# EAGLE design Uplink_controller (EAGLE 5.06)
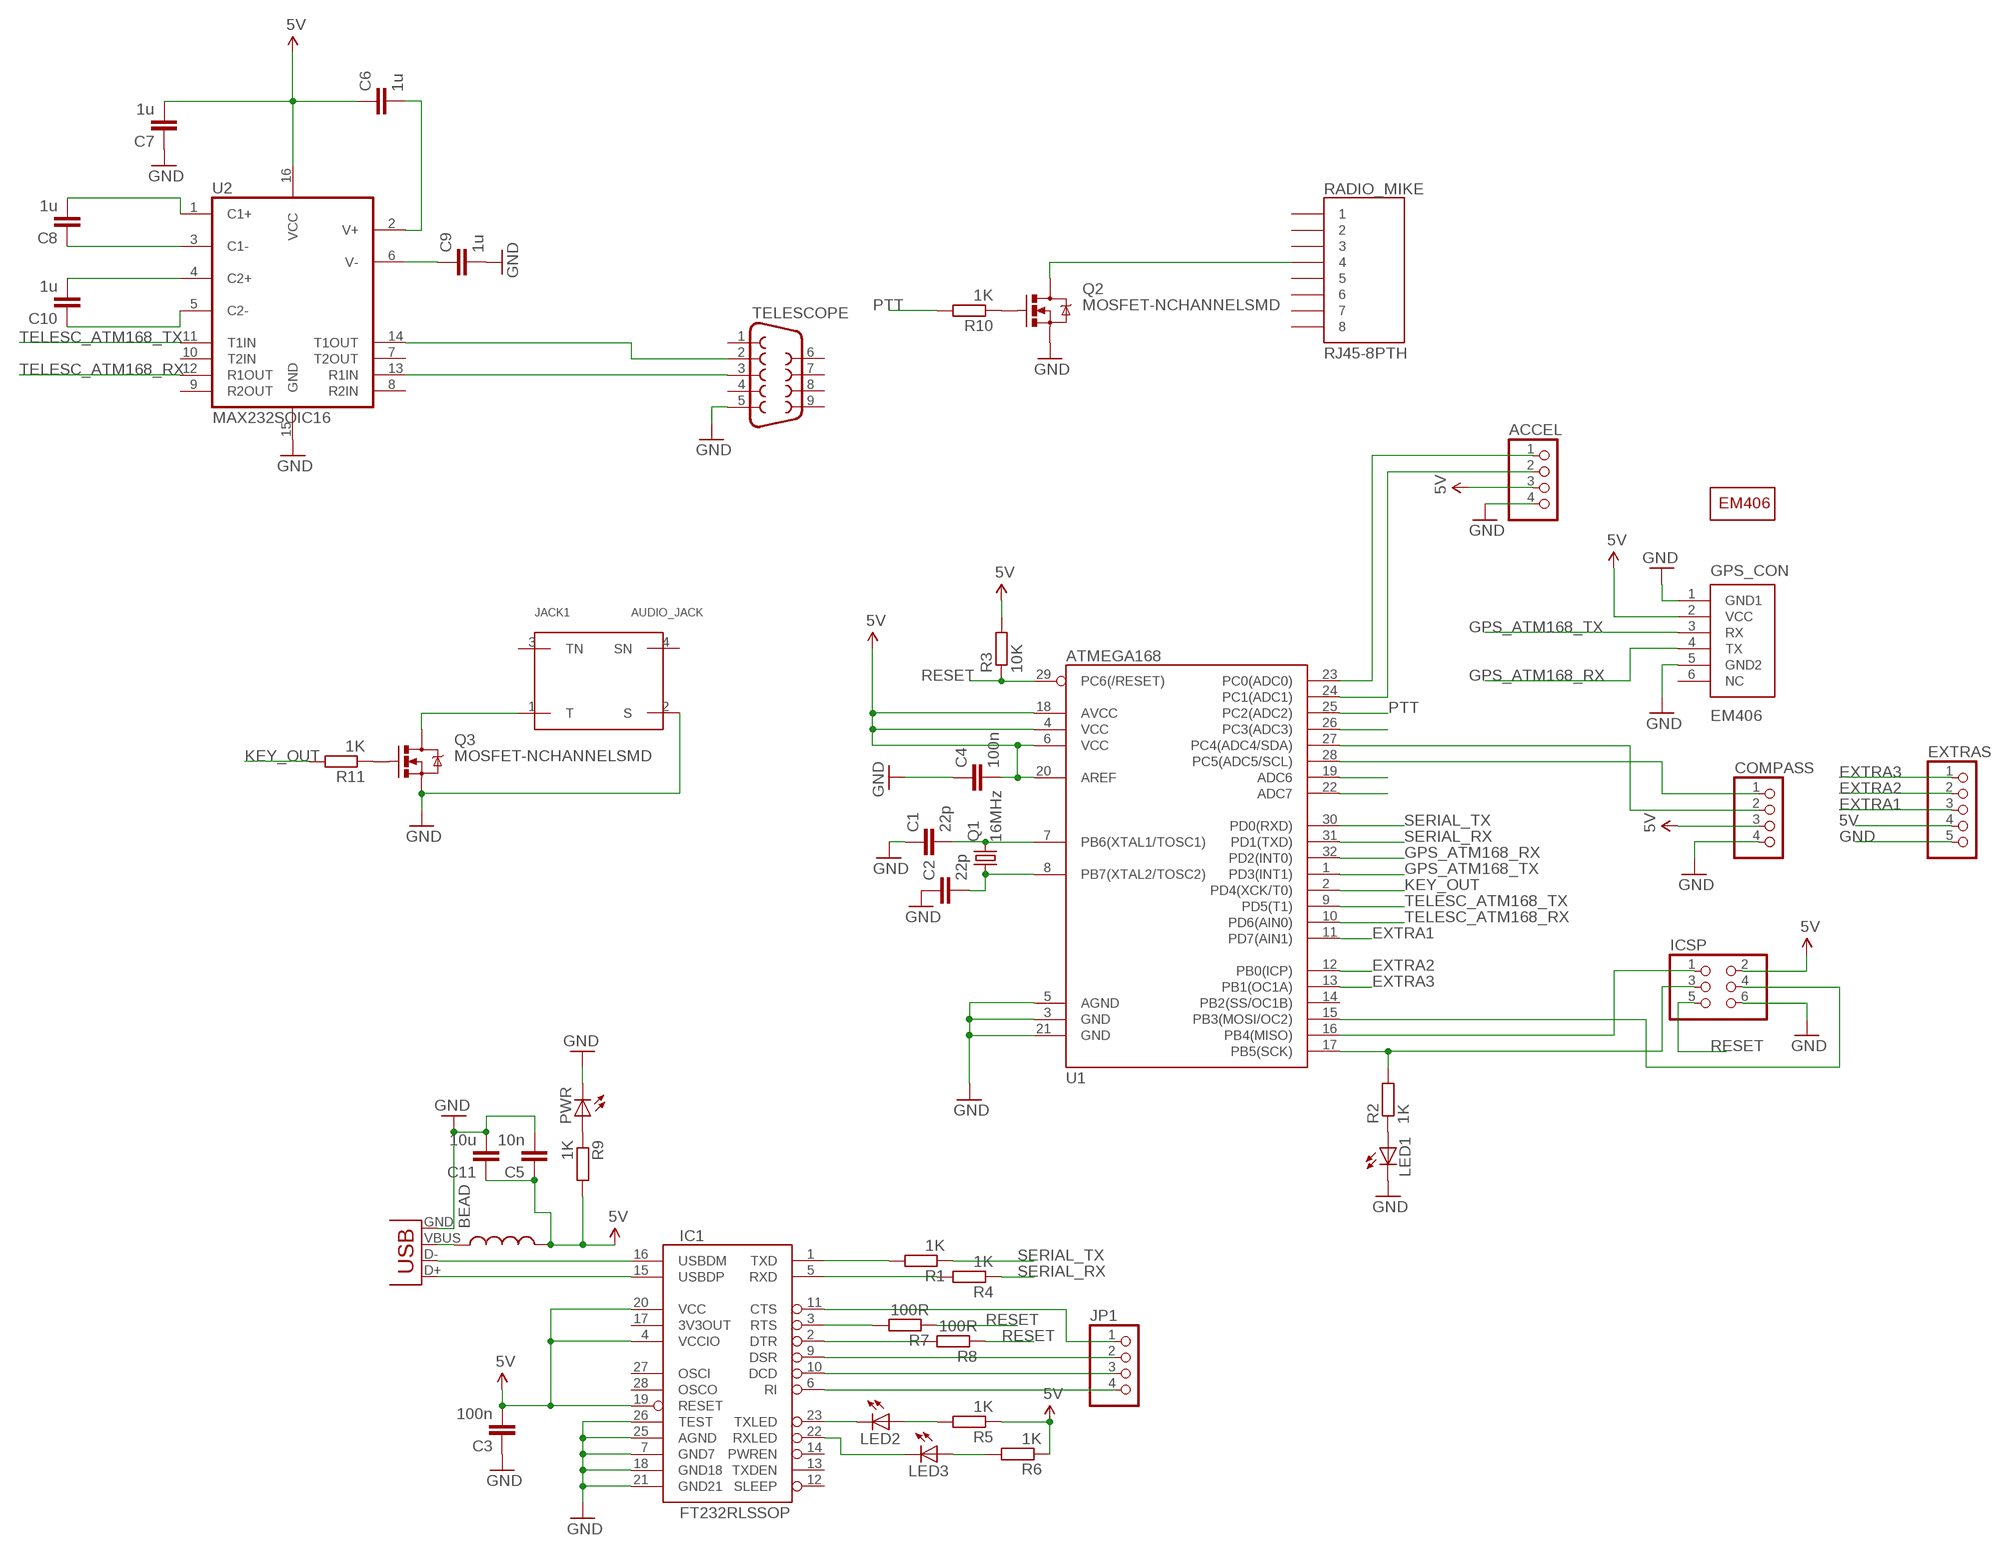
[diagram p0: schematic, sheet 1]

## Parts
ACCEL  PINHD-1X4  [1X04]
BEAD  INDUCTOR0603  [0603]
C1  22p  CAP0603-CAP  [0603-CAP]
C2  22p  CAP0603-CAP  [0603-CAP]
C3  100n  CAP0603-CAP  [0603-CAP]
C4  100n  CAP0603-CAP  [0603-CAP]
C5  10n  CAP0603-CAP  [0603-CAP]
C6  1u  CAP0603-CAP  [0603-CAP]
C7  1u  CAP0603-CAP  [0603-CAP]
C8  1u  CAP0603-CAP  [0603-CAP]
C9  1u  CAP0603-CAP  [0603-CAP]
C10  1u  CAP0603-CAP  [0603-CAP]
C11  10u  CAP0603-CAP  [0603-CAP]
COMPASS  PINHD-1X4  [1X04]
EXTRAS  PINHD-1X5  [1X05]
GPS_CON  EM406  [EM406]
IC1  FT232RLSSOP  [SSOP28DB]
ICSP  PINHD-2X3  [2X03]
JACK1  AUDIO_JACK  [AUDIO_JACK_NMJ4HFD2]
JP1  PINHD-1X4  [1X04]
LED1  LEDCHIPLED_0603  [CHIPLED_0603]
LED2  LEDCHIPLED_0603  [CHIPLED_0603]
LED3  LEDCHIPLED_0603  [CHIPLED_0603]
PWR  LEDCHIPLED_0603  [CHIPLED_0603]
Q1  16MHz  CRYSTAL5X3  [CRYSTAL-SMD-5X3]
Q2  MOSFET-NCHANNELSMD  [SOT23-3]
Q3  MOSFET-NCHANNELSMD  [SOT23-3]
R1  1K  R-EU_R0603  [R0603]
R2  1K  R-EU_R0603  [R0603]
R3  10K  R-EU_R0603  [R0603]
R4  1K  R-EU_R0603  [R0603]
R5  1K  R-EU_R0603  [R0603]
R6  1K  R-EU_R0603  [R0603]
R7  100R  R-EU_R0603  [R0603]
R8  100R  R-EU_R0603  [R0603]
R9  1K  R-EU_R0603  [R0603]
R10  1K  R-EU_R0603  [R0603]
R11  1K  R-EU_R0603  [R0603]
RADIO_MIKE  RJ45-8PTH  [RJ45-8]
TELESCOPE  DB9  [DB9]
U1  ATMEGA168  [TQFP32-08]
U2  MAX232SOIC16  [SO016]
U$7  EM406_OUTLINE  [EM406_OUTLINE]
X1  USBSMD  [USB-MINIB]

## Nets
5V: ACCEL.3 BEAD.2 C3.2 C4.2 C5.1 C6.1 C7.2 C11.1 COMPASS.3 EXTRAS.4 GPS_CON.2(VCC) IC1.4(VCCIO) IC1.19(RESET) IC1.20(VCC) ICSP.2 R3.2 R5.1 R6.1 R9.2 U1.4(VCC) U1.6(VCC) U1.18(AVCC) U1.20(AREF) U2.16(VCC)
EXTRA1: EXTRAS.3 U1.11(PD7(AIN1))
EXTRA2: EXTRAS.2 U1.12(PB0(ICP))
EXTRA3: EXTRAS.1 U1.13(PB1(OC1A))
GND: ACCEL.4 C1.1 C2.1 C3.1 C4.1 C5.2 C7.1 C9.2 C11.2 COMPASS.4 EXTRAS.5 GPS_CON.1(GND1) GPS_CON.5(GND2) IC1.7(GND7) IC1.18(GND18) IC1.21(GND21) IC1.25(AGND) IC1.26(TEST) ICSP.6 JACK1.2(S) LED1.C PWR.C Q2.2(S) Q3.2(S) TELESCOPE.5 U1.3(GND) U1.5(AGND) U1.21(GND) U2.15(GND) X1.GND
GPS_ATM168_RX: GPS_CON.4(TX) U1.32(PD2(INT0))
GPS_ATM168_TX: GPS_CON.3(RX) U1.1(PD3(INT1))
KEY_OUT: R11.2 U1.2(PD4(XCK/T0))
MISO: ICSP.1 U1.16(PB4(MISO))
MOSI: ICSP.4 U1.15(PB3(MOSI/OC2))
N$1: C1.2 Q1.3 U1.7(PB6(XTAL1/TOSC1))
N$2: C2.2 Q1.1 U1.8(PB7(XTAL2/TOSC2))
N$4: LED1.A R2.1
N$6: IC1.1(TXD) R1.2
N$7: IC1.5(RXD) R4.2
N$8: LED2.A R5.2
N$9: IC1.23(TXLED) LED2.C
N$10: IC1.22(RXLED) LED3.C
N$11: LED3.A R6.2
N$12: IC1.16(USBDM) X1.D-
N$13: IC1.15(USBDP) X1.D+
N$14: TELESCOPE.3 U2.13(R1IN)
N$15: IC1.6(RI) JP1.4
N$16: IC1.10(DCD) JP1.3
N$17: IC1.9(DSR) JP1.2
N$18: IC1.11(CTS) JP1.1
N$19: IC1.3(RTS) R7.2
N$20: IC1.2(DTR) R8.2
N$21: Q2.3(D) RADIO_MIKE.4
N$22: JACK1.1(T) Q3.3(D)
N$24: PWR.A R9.1
N$25: Q2.1(G) R10.1
N$26: C8.2 U2.1(C1+)
N$27: COMPASS.1 U1.28(PC5(ADC5/SCL))
N$28: COMPASS.2 U1.27(PC4(ADC4/SDA))
N$29: C8.1 U2.3(C1-)
N$30: ACCEL.1 U1.23(PC0(ADC0))
N$31: C10.2 U2.4(C2+)
N$32: C10.1 U2.5(C2-)
N$33: C9.1 U2.6(V-)
N$34: C6.2 U2.2(V+)
N$35: Q3.1(G) R11.1
N$36: BEAD.1 X1.VBUS
N$39: U1.26(PC3(ADC3))
N$40: U1.19(ADC6)
N$41: U1.22(ADC7)
N$42: ACCEL.2 U1.24(PC1(ADC1))
PTT: R10.2 U1.25(PC2(ADC2))
RAND: TELESCOPE.2 U2.14(T1OUT)
RESET: ICSP.5 R3.1 R7.1 R8.1 U1.29(PC6(/RESET))
SCK: ICSP.3 R2.2 U1.17(PB5(SCK))
SERIAL_RX: R4.1 U1.31(PD1(TXD))
SERIAL_TX: R1.1 U1.30(PD0(RXD))
TELESC_ATM168_RX: U1.10(PD6(AIN0)) U2.12(R1OUT)
TELESC_ATM168_TX: U1.9(PD5(T1)) U2.11(T1IN)
Unconnected: GPS_CON.6(NC) IC1.12(SLEEP) IC1.13(TXDEN) IC1.14(PWREN) IC1.17(3V3OUT) IC1.27(OSCI) IC1.28(OSCO) JACK1.3(TN) JACK1.4(SN) RADIO_MIKE.1 RADIO_MIKE.2 RADIO_MIKE.3 RADIO_MIKE.5 RADIO_MIKE.6 RADIO_MIKE.7 RADIO_MIKE.8 TELESCOPE.1 TELESCOPE.4 TELESCOPE.6 TELESCOPE.7 TELESCOPE.8 TELESCOPE.9 U1.14(PB2(SS/OC1B)) U2.7(T2OUT) U2.8(R2IN) U2.9(R2OUT) U2.10(T2IN)

## Library data of the parts
ACCEL COMPASS JP1 = pinhead:PINHD-1X4: PIN HEADER
BEAD = SparkFun:INDUCTOR: Inductors Basic Inductor/Choke - 0603 and 1206. Footprints are not proven and vary greatly between part numbers.
C1-C11 = SparkFun:CAP: Capacitor Standard 0603 ceramic capacitor, and 0.1" leaded capacitor.
EXTRAS = pinhead:PINHD-1X5: PIN HEADER
GPS_CON = SparkFun:EM406: EM406 Connector Proven layout and schematic for EM406 connector. Spark Fun Electronics SKU : GPS-00579
IC1 = SparkFun:FT232RL: USB UART FT232RL 4th Generation USB UART (USB <-> Serial) Controller. Spark Fun Electronics SKU : COM-00650
ICSP = pinhead:PINHD-2X3: PIN HEADER
JACK1 = uplink_controller:AUDIO_JACK
LED1-LED3 PWR = led:LED: LED OSRAM: - CHIPLED LG R971, LG N971, LY N971, LG Q971, LY Q971, LO R971, LY R971 LH N974, LH R974 LS Q976, LO Q976, LY Q976 LO Q996 - Hyper CHIPLED LW Q18S LB Q993, LB Q99A, LB R99A - SideLED LS A670, LO A670, LY A670, LG A670, LP A670 LB A673, LV A673, LT A673, LW A673 LH A674 LY A675 LS A676, LA A676, LO A676, LY A676, LW A676 LS A679, LY A679, LG A679 - Hyper Micro SIDELED® LS Y876, LA Y876, LO Y876, LY Y876 LT Y87S - SmartLED LW L88C, LW L88S LB L89C, LB L89S, LG L890 LS L89K, LO L89K, LY L89K LS L896, LA L896, LO L896, LY L896 - TOPLED LS T670, LO T670, LY T670, LG T670, LP T670 LSG T670, LSP T670, LSY T670, LOP T670, LYG T670 LG T671, LOG T671, LSG T671 LB T673, LV T673, LT T673, LW T673 LH T674 LS T676, LA T676, LO T676, LY T676, LB T676, LH T676, LSB T676, LW T676 LB T67C, LV T67C, LT T67C, LS T67K, LO T67K, LY T67K, LW E67C LS E67B, LA E67B, LO E67B, LY E67B, LB E67C, LV E67C, LT E67C LW T67C LS T679, LY T679, LG T679 LS T770, LO T770, LY T770, LG T770, LP T770 LB T773, LV T773, LT T773, LW T773 LH T774 LS E675, LA E675, LY E675, LS T675 LS T776, LA T776, LO T776, LY T776, LB T776 LHGB T686 LT T68C, LB T68C - Hyper Mini TOPLED® LB M676 - Mini TOPLED Santana® LG M470 LS M47K, LO M47K, LY M47K Source: http://www.osram.convergy.de LUXEON: - LUMILED® LXK2-PW12-R00, LXK2-PW12-S00, LXK2-PW14-U00, LXK2-PW14-V00 LXK2-PM12-R00, LXK2-PM12-S00, LXK2-PM14-U00 LXK2-PE12-Q00, LXK2-PE12-R00, LXK2-PE12-S00, LXK2-PE14-T00, LXK2-PE14-U00 LXK2-PB12-K00, LXK2-PB12-L00, LXK2-PB12-M00, LXK2-PB14-N00, LXK2-PB14-P00, LXK2-PB14-Q00 LXK2-PR12-L00, LXK2-PR12-M00, LXK2-PR14-Q00, LXK2-PR14-R00 LXK2-PD12-Q00, LXK2-PD12-R00, LXK2-PD12-S00 LXK2-PH12-R00, LXK2-PH12-S00 LXK2-PL12-P00, LXK2-PL12-Q00, LXK2-PL12-R00 Source: www.luxeon.com KINGBRIGHT: KA-3528ASYC Source: www.kingbright.com
Q1 = SparkFun:CRYSTAL: Crystals Various standard crystals. Proven footprints. Spark Fun Electronics SKU : COM-00534
Q2 Q3 = SparkFun:MOSFET-NCHANNEL
R1-R11 = rcl:R-EU_: RESISTOR, European symbol
RADIO_MIKE = SparkFun:RJ45-8: RJ45 Jack Simple RJ45, 8-pin connection - connector for common Cat5, Cat5e, and Cat6 Ethernet cables. Footprint not yet proven in production. Connector sku is PRT-00643; Breakout PCB sku is BOB-00716.
TELESCOPE = SparkFun:DB9: DB9 Connector Standard DB9 (D-Sub 9) serial connector. Can be used for CAN bus as well as RS485 and RS232. Footprint production proven. Spark Fun Electronics SKU : PRT-00429
U1 = SparkFun:ATMEGA168
U2 = SparkFun:MAX232: RS232 Transceiver Very common IC. This is generically called 'MAX232', but works with the 3V equivalent MAX3232 generic ICs. Field tested and mother approved. Spark Fun Electronics SKU : COM-00316 (DIP) and COM-00589 (SMD)
U$7 = SparkFun:EM406_OUTLINE
X1 = SparkFun:USB: USB Connectors USB-B-PTH is fully proven SKU : PRT-00139 USB-miniB is fully proven SKU : PRT-00587 USB-A-PCB is untested. USB-A-H is throughly reviewed, but untested. Spark Fun Electronics SKU : PRT-00437 USB-B-SMT is throughly reviewed, but untested. Needs silkscreen touching up. USB-A-S has not been used/tested USB-MB-H has not been used/tested

## Board
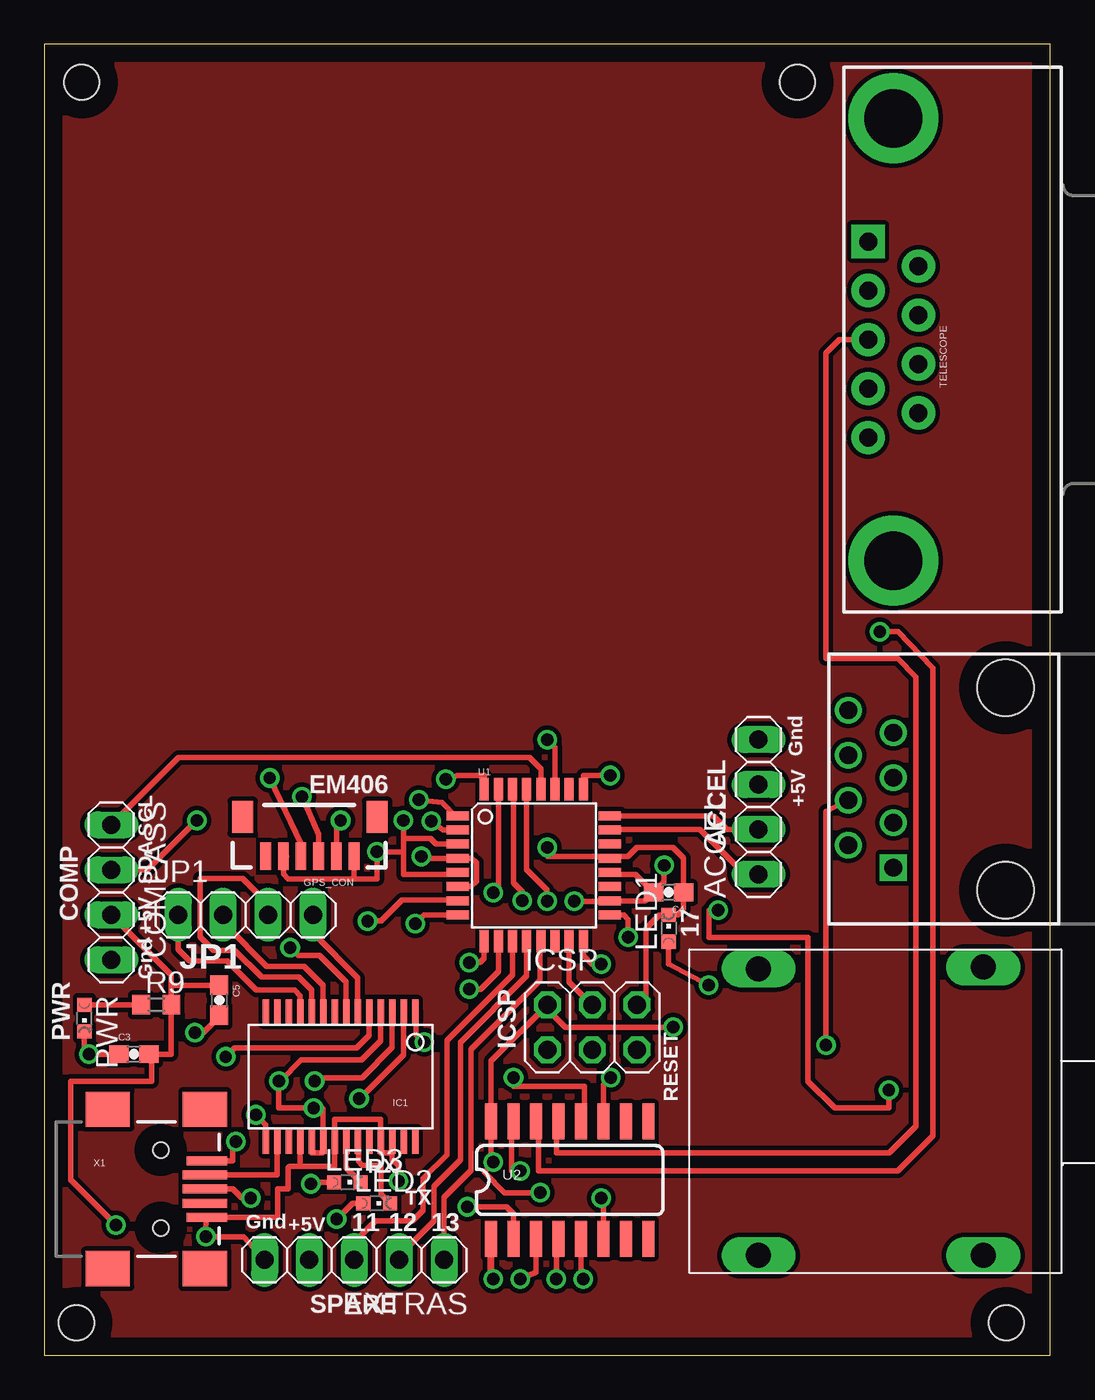
[diagram p1: board, top side]
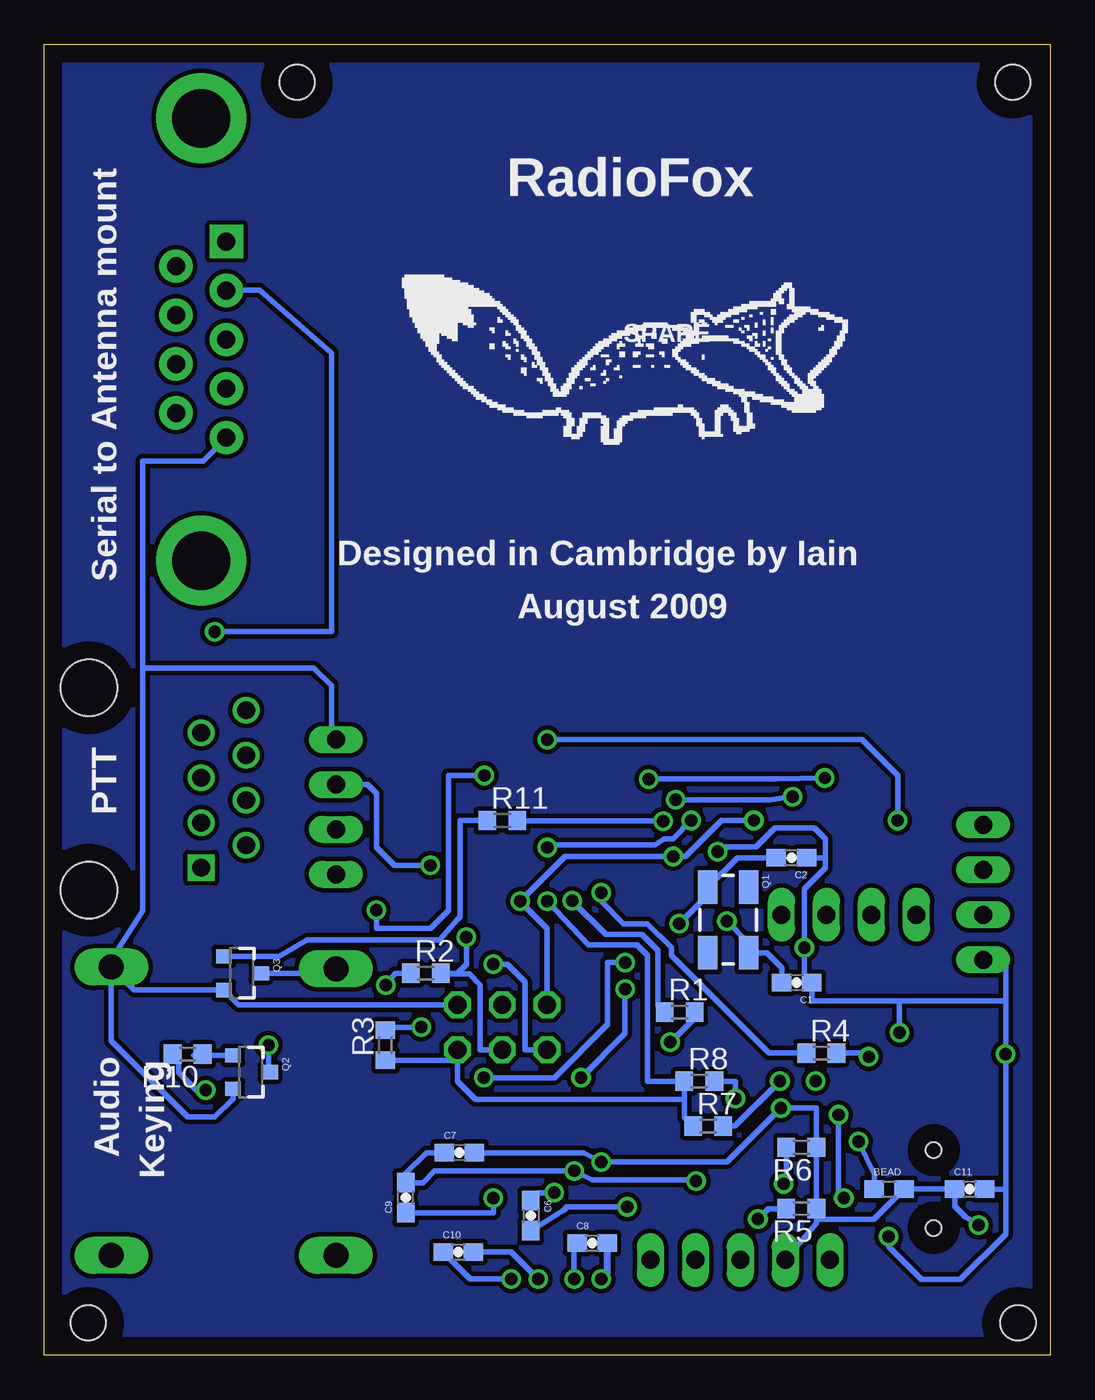
[diagram p2: board, bottom side, seen from below]

Size 56.86 x 74.09 mm. Coordinates in mm from the lower left corner, seen from the top.
Outline: 0,0 56.86,0 56.86,74.09 0,74.09 0,0
Copper layers (1*16): Top 0.035mm / dielectric 1.5mm / Bottom 0.035mm
Design rules "olimex10mils": minimum track width 10mil, minimum drill 24mil, track to track 10mil, track to pad 10mil, pad to pad 10mil, via to via 10mil, smd to smd 10mil, copper to edge 40mil, drill to drill 10mil, minimum pad ring 10mil, minimum via ring 8mil, stop-mask expansion 0mil, vias tented up to drill 0mil, thermal gap 10mil
Holes 2 mm at 42.57,71.94 54.37,1.84 1.82,1.84 2.12,71.94

### Footprints (pad centres in the part's own frame; a part is rotated, then mirrored left to right if it is on the bottom)
1X04 = drill 1.016 long: 1 -3.81,0; 2 -1.27,0; 3 1.27,0; 4 3.81,0
0603 = smd 1.1 x 1: 1 -0.85,0; 2 0.85,0
0603-CAP = smd 1.1 x 1: 1 -0.85,0; 2 0.85,0
1X05 = drill 1.016 long: 1 -5.08,0; 2 -2.54,0; 3 0,0; 4 2.54,0; 5 5.08,0
EM406 = smd 0.6 x 1.55: 1 0,0; 2 1,0; 3 2,0; 4 3,0; 5 4,0; 6 5,0 | smd 1.2 x 1.8: P$1 -1.3,-2.225; P$2 6.3,-2.225
SSOP28DB = smd 0.348 x 1.397: 1 -4.225,-3.656; 2 -3.575,-3.656; 3 -2.925,-3.656; 4 -2.275,-3.656; 5 -1.625,-3.656; 6 -0.975,-3.656; 7 -0.325,-3.656; 8 0.325,-3.656; 9 0.975,-3.656; 10 1.625,-3.656; 11 2.275,-3.656; 12 2.925,-3.656; 13 3.575,-3.656; 14 4.225,-3.656; 15 4.225,3.656; 16 3.575,3.656; 17 2.925,3.656; 18 2.275,3.656; 19 1.625,3.656; 20 0.975,3.656; 21 0.325,3.656; 22 -0.325,3.656; 23 -0.975,3.656; 24 -1.625,3.656; 25 -2.275,3.656; 26 -2.925,3.656; 27 -3.575,3.656; 28 -4.225,3.656
2X03 = drill 1.016 octagon: 1 -2.54,-1.27; 2 -2.54,1.27; 3 0,-1.27; 4 0,1.27; 5 2.54,-1.27; 6 2.54,1.27
AUDIO_JACK_NMJ4HFD2 = drill 1.4 long: 1 0,0; 2 12.7,0.1; 3 0,-16.2; 4 12.7,-16.2
CHIPLED_0603 = smd 0.8 x 0.8: A 0,-0.75; C 0,0.75
CRYSTAL-SMD-5X3 = smd 1.9 x 1.1: 1 -1.85,-1.15; 2 1.85,-1.15; 3 1.85,1.15; 4 -1.85,1.15
SOT23-3 = smd 0.8 x 0.9: 1 -0.95,-1; 2 0.95,-1; 3 0,1.1
R0603 = smd 1 x 1.1: 1 -0.85,0; 2 0.85,0
RJ45-8 = drill 1 square: 1 -4.445,6.35 | drill 1 round: 2 -3.175,8.89; 3 -1.905,6.35; 4 -0.635,8.89; 5 0.635,6.35; 6 1.905,8.89; 7 3.175,6.35; 8 4.445,8.89 | hole 3.2: -5.715,0; 5.715,0
DB9 = drill 1.016 pad 1.88 square: 1 -5.54,-1.42 | drill 1.016 pad 1.88 round: 2 -2.77,-1.42; 3 0,-1.42; 4 2.77,-1.42; 5 5.54,-1.42; 6 -4.15,1.42; 7 -1.38,1.42; 8 1.38,1.42; 9 4.15,1.42 | drill 3.302 pad 5.08 round: G1 -12.5,0; G2 12.5,0
TQFP32-08 = smd 1.27 x 0.508: 1 -4.293,2.8; 2 -4.293,2; 3 -4.293,1.2; 4 -4.293,0.4; 5 -4.293,-0.4; 6 -4.293,-1.2; 7 -4.293,-2; 8 -4.293,-2.8; 17 4.293,-2.8; 18 4.293,-2; 19 4.293,-1.2; 20 4.293,-0.4; 21 4.293,0.4; 22 4.293,1.2; 23 4.293,2; 24 4.293,2.8 | smd 0.508 x 1.27: 9 -2.8,-4.293; 10 -2,-4.293; 11 -1.2,-4.293; 12 -0.4,-4.293; 13 0.4,-4.293; 14 1.2,-4.293; 15 2,-4.293; 16 2.8,-4.293; 25 2.8,4.293; 26 2,4.293; 27 1.2,4.293; 28 0.4,4.293; 29 -0.4,4.293; 30 -1.2,4.293; 31 -2,4.293; 32 -2.8,4.293
SO016 = smd 0.66 x 2.032: 1 -4.445,-3.315; 2 -3.175,-3.315; 3 -1.905,-3.315; 4 -0.635,-3.315; 5 0.635,-3.315; 6 1.905,-3.315; 7 3.175,-3.315; 8 4.445,-3.315; 9 4.445,3.315; 10 3.175,3.315; 11 1.905,3.315; 12 0.635,3.315; 13 -0.635,3.315; 14 -1.905,3.315; 15 -3.175,3.315; 16 -4.445,3.315
USB-MINIB = smd 2.5 x 0.5: D+ 2.5,0; D- 2.5,0.8; ID 2.5,-0.8 | smd 2.3 x 0.5: GND 2.6,-1.6; VBUS 2.6,1.6 | smd 2.5 x 2: GND@1 -3,-4.5; GND@2 -3,4.5; GND@3 2.5,4.5; GND@4 2.5,-4.5 | hole 0.9: 0,2.2; 0,-2.2

### Placement (x,y rotation side)
ACCEL  40.37,30.99 90 top
BEAD  9.11,9.4 0 bottom
C1  14.33,21.05 180 bottom
C2  14.63,28.11 180 bottom
C3  5.06,17.02 0 top
C4  35.29,26.16 180 top
C5  9.89,20.06 270 top
C6  29.36,7.89 270 bottom
C7  33.39,11.45 0 bottom
C8  25.89,6.34 0 bottom
C9  36.43,8.9 90 bottom
C10  33.46,5.84 0 bottom
C11  4.56,9.4 0 bottom
COMPASS  3.79,26.16 270 top
EXTRAS  17.52,5.39 180 top
GPS_CON  17.51,28.19 180 top
IC1  16.75,15.75 180 top
ICSP  30.97,18.54 0 top
JACK1  40.37,21.84 0 top
JP1  11.38,24.89 0 top
LED1  35.29,24.13 0 top
LED2  18.79,8.59 270 top
LED3  17.14,9.78 270 top
PWR  2.27,19.05 180 top
Q1  18.2,24.61 270 bottom
Q2  45.2,16 270 bottom
Q3  45.7,21.59 270 bottom
R1  20.95,19.4 0 bottom
R2  35.29,21.59 0 bottom
R3  37.58,17.52 90 bottom
R4  12.94,17.08 0 bottom
R5  14.07,8.29 180 bottom
R6  14.07,11.75 180 bottom
R7  19.34,12.95 0 bottom
R8  19.84,15.49 0 bottom
R9  6.33,19.81 0 top
R10  48.75,17.02 180 bottom
R11  30.97,30.22 0 bottom
RADIO_MIKE  54.34,32 90 top
TELESCOPE  47.99,57.4 270 top
U1  27.67,27.68 0 top
U2  29.7,9.9 0 top
U$7  6.33,-3.3 90 top  (outside the outline)
X1  6.59,9.4 0 top

### Tracks (layer width: path | path; a pad name or v marks a point on that pad's centre or on a via)
5V  (via drill 0.7)
  Top 0.305: IC1.19 15.12,11.43 15.73,11.43 15.73,12.09 IC1.20 15.77,13.93 v15.22,13.97 13.26,13.97 v13.26,15.49 13.33,15.49 14.52,16.69 17.94,16.69 19.02,17.77 IC1.4 | v29.96,25.65 31.93,25.65 arc90 U1.18 33.96,25.68 C4.2 | v21.32,28.19 21.72,28.08 U1.4 24.18,28.08 24.42,27.84 24.42,26.79 24.12,26.49 U1.6 | GPS_CON.2 16.51,30.22 v16.75,30.22 | v35.54,18.54 29.45,18.54 28.43,19.56 ICSP.2 25.26,16.63 U2.16 25.26,11.04 v25.38,10.92 24.88,10.34 26.02,9.19 v28.02,9.19 | R9.2 7.18,20.91 | 7.18,20.91 C5.1 | R9.2 7.44,19.56 | v4.05,7.36 1.51,9.9 1.51,15.49 6.08,15.49 6.08,17.02 C3.2 7.18,17.02 R9.2 | COMPASS.3 7.18,21.5 7.18,20.91 | U1.20 32.07,27.18 33.42,27.18 C4.2 | C4.2 35.04,26.76 v35.04,27.68
  Bottom 0.305: C7.2 26.38,11.45 v25.38,10.92 18.27,10.92 v15.22,13.97 13.22,13.97 R6.1 R5.1 | ICSP.2 28.43,24.13 v29.96,25.65 27.42,28.19 v21.32,28.19 20.62,28.19 18.59,30.22 v16.75,30.22 | R3.2 37.41,18.54 v35.54,18.54 | v35.04,27.68 37.07,27.68 38.08,28.7 38.08,31.75 38.59,32.26 ACCEL.3 | v4.05,7.36 4.81,7.81 5.41,8.41 C11.1 | R5.1 13.22,7.69 9.97,7.69 BEAD.2 C11.1 | C6.1 28.91,9.19 v28.02,9.19 | EXTRAS.4 13.22,7.45 R5.1 | C11.1 5.15,9.14
EXTRA1
  Top 0.305: U1.11 26.47,21.48 22.77,17.79 22.77,11.34 21.42,9.99 21.42,8.19 20.82,7.59 18.72,7.59 17.82,6.69 17.82,5.99 EXTRAS.3
EXTRA2
  Top 0.305: U1.12 27.27,21.43 23.52,17.69 23.52,11.04 22.02,9.54 22.02,7.59 20.12,5.69 EXTRAS.2 20.02,5.73
EXTRA3
  Top 0.305: U1.13 28.02,23.39 28.02,21.19 24.12,17.29 24.12,10.44 22.6,8.92 EXTRAS.1
GND  (via drill 0.7)
  Top 0.305: 14.47,10.69 IC1.18 | 19.67,11.43 19.02,11.43 IC1.25 19.02,13.34 16.42,13.34 IC1.21 16.42,10.69 14.47,10.69 | 19.67,11.43 IC1.26 | U2.15 26.4,13.09 26.4,10.42 v26.9,10.42 | 19.67,11.43 19.67,11.04 20.02,10.69 v20.02,9.84 | ICSP.6 34.02,20.32 34.02,24.13 34.77,24.88 LED1.C 35.79,24.88 36.14,25.23 C4.1 36.14,28.1 35.54,28.7 33.51,28.7 33,28.19 32.07,28.19 U1.21 31.96,28.19 28.43,28.19 v28.43,28.7 | 17.51,26.92 GPS_CON.1 | 20.3,28.44 20.3,29.21 | 20.3,28.44 20.3,27.18 23.27,27.18 U1.5 | 20.3,29.21 21.83,29.21 22.15,28.88 U1.3 | 20.3,29.21 v20.3,30.22 | PWR.C 2.27,17.02 v2.52,17.02 C3.1 | GPS_CON.5 13.7,28.19 13.52,28.02 13.52,27.19 13.79,26.92 17.51,26.92 | C5.2 9.98,19.21 9,18.24 v8.52,18.24 | EXTRAS.5 11.28,6.71 v9.13,6.71 9.09,6.9 X1.GND 13.19,7.8 13.19,9.4 13.77,9.4 13.77,10.59 13.87,10.69 14.47,10.69 | 20.3,28.44 18.83,28.44 v18.8,28.47 18.8,26.92 17.51,26.92 | IC1.7 17.07,21.09 15.57,22.59 14.34,22.59 v13.9,23.03
  Bottom 0.305: JACK1.2 51.77,20.64 Q3.2 45.88,19.81 ICSP.6 | Q2.2 46.2,14.49 47.23,13.46 48.75,13.46 53.07,17.78 JACK1.2 | COMPASS.4 2.52,22.35 2.52,20.04 | 2.52,20.04 v2.52,17.02 2.52,9.39 | TELESCOPE.5 47.89,50.54 51.3,50.54 51.3,38.85 | 51.3,38.85 51.3,25.12 53.07,22.35 JACK1.2 | ACCEL.4 40.62,35.05 40.62,37.84 41.63,38.85 51.3,38.85 | v9.13,6.71 9.13,6.14 7.27,4.29 5.07,4.29 2.52,6.84 2.52,9.39 | C7.1 35.26,11.45 36.43,10.28 C9.2 35.46,9.75 34.79,10.42 v26.9,10.42 25.9,9.92 20.02,9.92 v20.02,9.84 | 12.72,28.14 12.72,27.54 13.9,26.36 v13.9,23.03 13.9,21.36 13.48,20.94 | 12.72,28.14 12.72,29.19 13.32,29.79 15.57,29.79 16.62,28.74 18.53,28.74 v18.8,28.47 | C2.1 12.75,28.11 12.72,28.14 | 13.48,20.94 C1.1 | 13.48,20.94 13.47,20.94 | C11.2 2.52,9.39 | v28.43,28.7 28.28,28.85 22.34,28.85 21.85,29.19 21.34,29.19 v20.3,30.22 | 13.48,20.94 13.48,20.04 8.52,20.04 | 2.52,20.04 8.52,20.04 | 8.52,20.04 v8.52,18.24
GPS_ATM168_RX  (via drill 0.7)
  Top 0.305: GPS_CON.4 14.51,28.91 v12.74,32.62 | v22.69,32.56 23.35,32.76 24.88,32.76 24.87,32.76 U1.32
  Bottom 0.305: v22.69,32.56 15.52,32.56 v12.74,32.62
GPS_ATM168_TX  (via drill 0.7)
  Top 0.305: GPS_CON.3 15.51,29.43 v14.57,31.57 | v21.17,31.39 22.47,31.24 23.23,30.48 U1.1
  Bottom 0.305: v21.17,31.39 15.88,31.39 v14.57,31.57
KEY_OUT  (via drill 0.7)
  Top 0.305: U1.2 22.53,29.68 v21.87,30.19
  Bottom 0.305: v21.87,30.19 30.09,30.19 R11.2
MISO  (via drill 0.7)
  Top 0.305: U1.16 30.46,22.6 30.97,22.1 v31.48,22.1
  Bottom 0.305: ICSP.1 29.67,17.27 29.67,21.09 30.68,22.1 v31.48,22.1
MOSI
  Top 0.305: U1.15 29.67,21.11 ICSP.4
N$1  (via drill 0.7)
  Top 0.305: U1.7 23.32,25.74 20.22,25.74 19.02,24.54 v18.27,24.54
  Bottom 0.305: C1.2 15.18,21.89 16.02,22.74 17.03,22.74 Q1.3 17.05,23.31 v18.27,24.54
N$2  (via drill 0.7)
  Top 0.305: v20.97,24.39 21.47,24.88 U1.8
  Bottom 0.305: C2.2 17.69,28.11 Q1.1 19.35,26.01 v20.97,24.39
N$4  (via drill 0.7)
  Top 0.305: LED1.A 35.29,22.11 v37.56,20.91
  Bottom 0.305: v37.56,20.91 37.04,21.59 R2.1
N$6  (via drill 0.7)
  Top 0.305: IC1.1 21.02,19.4 21.02,18.14 v21.47,17.69
  Bottom 0.305: R1.2 20.1,19.07 v21.47,17.69
N$7  (via drill 0.7)
  Top 0.305: v10.26,16.87 10.76,17.37 17.66,17.37 18.37,18.09 IC1.5
  Bottom 0.305: v10.26,16.87 10.47,17.08 R4.2
N$8  (via drill 0.7)
  Top 0.305: LED2.A 17.42,8.59 v16.52,7.69
  Bottom 0.305: R5.2 15.92,8.29 v16.52,7.69
N$9
  Top 0.305: IC1.23 17.72,11.43 17.76,11.43 17.76,10.95 17.97,10.74 18.97,10.74 19.02,10.69 19.02,9.1 LED2.C
N$10
  Top 0.305: IC1.22 17.07,10.59 LED3.C
N$11  (via drill 0.7)
  Top 0.305: LED3.A 15.16,9.78 v15.07,9.69
  Bottom 0.305: R6.2 14.92,9.84 v15.07,9.69
N$12
  Top 0.305: 13.17,11.43 13.17,10.67 | 13.17,11.43 IC1.16 | X1.D- 13.17,10.2 13.17,11.43
N$13  (via drill 0.7)
  Top 0.305: X1.D+ 10.65,9.4 11.16,8.89 v11.67,8.89 | IC1.15 12.52,13.03 v11.97,13.59
  Bottom 0.305: v11.97,13.59 11.97,9.19 v11.67,8.89
N$14
  Top 0.305: U2.13 28.94,13.09 28.94,11.43 47.75,11.43 49.27,12.94 49.27,38.34 48.24,39.37 44.18,39.37 44.18,56.64 44.94,57.4 TELESCOPE.3
N$15
  Top 0.305: IC1.6 17.72,21.34 15.27,23.79 15.27,24.81 JP1.4
N$16
  Top 0.305: IC1.10 15.12,20.64 14.37,21.39 12.27,21.39 10.77,22.89 9.57,22.89 8.82,23.64 8.82,26.94 11.22,26.94 12.72,25.44 12.72,24.96 JP1.3
N$17
  Top 0.305: IC1.9 15.77,20.89 14.67,21.99 12.57,21.99 10.32,24.24 10.32,24.68 JP1.2
N$18
  Top 0.305: IC1.11 14.47,20.31 14.14,20.64 11.97,20.64 10.32,22.29 8.22,22.29 7.57,22.94 JP1.1
N$19  (via drill 0.7)
  Top 0.305: IC1.3 19.67,17.4 17.96,15.69 15.48,15.69 v15.28,15.48
  Bottom 0.305: R7.2 17.81,12.95 v15.28,15.48
N$20  (via drill 0.7)
  Top 0.305: IC1.2 20.32,16.99 17.84,14.5 v17.8,14.5
  Bottom 0.305: v17.8,14.5 17.79,15.49 R8.2
N$21  (via drill 0.7)
  Top 0.305: v44.18,17.52 44.18,30.73 RADIO_MIKE.4
  Bottom 0.305: Q2.3 44.18,16 v44.18,17.52
N$22
  Bottom 0.305: Q3.3 40.62,21.59 JACK1.1
N$24
  Top 0.305: PWR.A 5.47,19.8 R9.1
N$25
  Bottom 0.305: R10.1 48.41,16.95 Q2.1
N$26  (via drill 0.7)
  Top 0.406: U2.1 25.26,4.44 v25.38,4.32
  Bottom 0.406: v25.38,4.32 25.04,4.66 C8.2
N$27
  Top 0.305: COMPASS.1 7.6,33.78 27.42,33.78 28.07,33.13 U1.28
N$28  (via drill 0.7)
  Top 0.305: COMPASS.2 5.83,27.43 v8.62,30.22 | v28.43,34.8 28.87,34.36 U1.27
  Bottom 0.305: v8.62,30.22 8.62,32.76 10.65,34.8 v28.43,34.8
N$29  (via drill 0.7)
  Top 0.305: U2.3 27.8,4.7 v26.91,4.32
  Bottom 0.305: C8.1 26.91,6.17 v26.91,4.32
N$30
  Top 0.305: U1.23 32,29.72 37.07,29.72 39.61,27.18 ACCEL.1
N$31  (via drill 0.7)
  Top 0.305: v28.94,4.32 28.94,6.46 U2.4
  Bottom 0.305: v28.94,4.32 30.46,5.84 C10.2
N$32  (via drill 0.7)
  Top 0.305: U2.5 30.34,4.95 v30.46,4.32
  Bottom 0.305: C10.1 32.78,4.32 v30.46,4.32
N$33  (via drill 0.7)
  Top 0.305: v31.48,8.89 31.61,8.76 U2.6
  Bottom 0.305: C9.1 31.48,8.05 v31.48,8.89
N$34  (via drill 0.7)
  Top 0.305: U2.2 26.53,8 26.14,8.39 v23.9,8.39
  Bottom 0.305: C6.2 27.52,8.19 27.32,8.39 v23.9,8.39
N$35
  Bottom 0.305: Q3.1 43.59,22.54 42,23.47 34.53,23.47 33.51,24.64 33.36,24.79 33.36,30.22 R11.1
N$36  (via drill 0.7)
  Top 0.305: X1.VBUS 10.65,11 10.65,11.94 v10.84,12.09
  Bottom 0.305: v10.84,12.09 9.94,10.22 BEAD.1
N$37
  pour Bottom (isolate 0.254): -0.13,74.34 0.02,0.19 56.87,0.19 57.02,74.19
N$38
  pour Top (isolate 0.254): 0.02,74.19 0.02,0.19 56.72,0.19 57.02,74.19
N$42
  Top 0.305: ACCEL.2 38.59,29.72 37.82,30.48 U1.24
PTT  (via drill 0.7)
  Top 0.305: U1.25 30.46,32.76 v31.99,32.76 | v47.74,14.98 47.74,13.97 44.69,13.97 43.16,15.49 43.16,23.62 37.58,23.62 37.58,25.14 v38.08,25.14
  Bottom 0.305: v47.74,14.98 48.24,14.98 49.26,16 49.26,16.67 R10.2 | v38.08,25.14 38.08,24.13 35.04,24.13 34.02,25.14 34.02,32.76 v31.99,32.76
RAND  (via drill 0.7)
  Top 0.305: U2.14 27.92,13.09 27.92,10.41 48.25,10.41 50.23,12.4 50.23,38.85 48.24,40.89 v47.23,40.89 | TELESCOPE.2 46.55,60.2
  Bottom 0.305: v47.23,40.89 40.62,40.89 40.62,56.64 44.69,60.2 46.55,60.2 TELESCOPE.2
RESET  (via drill 0.7)
  Top 0.305: v28.42,25.65 28.42,26.29 27.27,27.44 U1.29
  Bottom 0.305: R3.1 33.51,16.67 ICSP.5 33.51,15.49 32.5,14.48 20.69,14.48 R8.1 | R7.1 20.69,13.45 R8.1 | R8.1 20.83,15.49 | v28.42,25.65 26.11,23.19 23.37,23.19 22.77,22.59 22.77,15.49 R8.1
SCK  (via drill 0.7)
  Top 0.305: v33,23.62 33,24.64 32.76,24.88 U1.17
  Bottom 0.305: v33,23.62 33,22.1 33.51,21.59 R2.2 34.39,21.54 32.82,21.54 32.22,20.94 32.22,17.27 ICSP.3
SERIAL_RX  (via drill 0.7)
  Top 0.305: v25.38,26.15 25.67,26.45 U1.31
  Bottom 0.305: R4.1 15.91,17.08 21.42,22.59 21.42,23.04 22.77,24.39 24.12,24.39 25.38,25.64 v25.38,26.15
SERIAL_TX  (via drill 0.7)
  Top 0.305: U1.30 26.52,31.98 26.52,26.69 27.02,26.19 v27.02,25.69
  Bottom 0.305: v27.02,25.69 25.12,23.79 23.07,23.79 22.17,22.89 22.17,19.78 R1.1
TELESC_ATM168_RX  (via drill 0.7)
  Top 0.305: U2.12 30.52,13.41 30.52,15.19 26.52,15.19 v26.52,15.69 | U1.10 25.67,21.69 24.67,20.69 v24.02,20.69
  Bottom 0.305: v24.02,20.69 24.02,18.19 v26.52,15.69
TELESC_ATM168_TX  (via drill 0.7)
  Top 0.305: v32.02,15.69 31.61,15.27 U2.11 | U1.9 24.87,22.43 24.62,22.19 v24.02,22.19
  Bottom 0.305: v32.02,15.69 28.02,15.69 25.02,18.69 25.02,22.19 v24.02,22.19

### Text on the board
tPlace: Gnd | EM406 | +5V | SCL | ACCEL | SDA | COMP | +5V | 17 | JP1 | Gnd | PWR | ICSP | RESET | RX | TX | Gnd | +5V | 11 | 12 | 13 | SPARE
bPlace: RadioFox | SPARE | Designed in Cambridge by Iain | Serial to Antenna mount | August 2009 | PTT | Audio | Keying
_tsilk: Gnd | EM406 | +5V | SCL | SDA | ACCEL | COMP | Gnd | 17 | JP1 | +5V | +5V | Gnd | PWR | ICSP | RESET | RX | Gnd | +5V | 11 | TX | 12 | 13 | SPARE
_bsilk: RadioFox | Uplink and Antenna Control | Serial to Aerial Mount | Designed in Cambridge by Iain | August 2009 | PTT | Keying | Radio